# Altium schematic sheet WPD_PLL.SchDoc
size A4; SheetNumber: 16; SheetTotal: 26
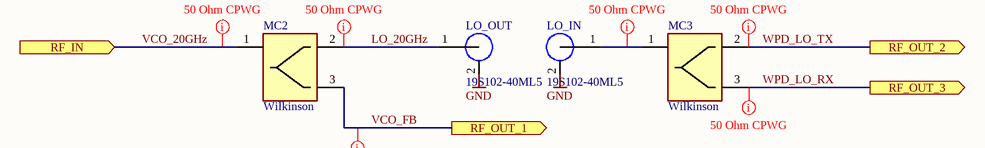
[diagram p0: WPD_PLL.SchDoc]

## Parts
LO_IN  19S102-40ML5  [Rosenberger_19S102-40ML5]
LO_OUT  19S102-40ML5  [Rosenberger_19S102-40ML5]
MC2  Wilkinson  [Wilkinson_8GHz_RO4350B_254um]  (net tie, no BOM)
MC3  Wilkinson  [Wilkinson_8GHz_RO4350B_254um]  (net tie, no BOM)

## Ports
RF_IN (in, see Top_Level[4B]), RF_OUT_1 (out, see Top_Level[4B]), RF_OUT_2 (out, see Top_Level[4B]), RF_OUT_3 (out, see Top_Level[4B])

## Nets
GND: LO_IN.2 LO_OUT.2
LO_20GHz: LO_OUT.1 MC2.2
VCO_20GHz: MC2.1 ; port RF_IN
VCO_FB: MC2.3 ; port RF_OUT_1
WPD_LO_RX: MC3.3 ; port RF_OUT_3
WPD_LO_TX: MC3.2 ; port RF_OUT_2
NetLO_IN_1: LO_IN.1 MC3.1

## Layout directives
net class 50Ohm_CPWG: LO_20GHz, NetLO_IN_1, VCO_20GHz, VCO_FB, WPD_LO_RX, WPD_LO_TX

## Library data of the parts
LO_IN LO_OUT = X000008: Manufacturer: Rosenberger; ID: X000008; Type: SMP Coax PCB Vertical Mount; Manufacturer Part Number: 19S102-40ML5; Part Value: 19S102-40ML5; ComponentLink1Description: Datasheet; ComponentLink1URL: https://products.rosenberger.com/_ocassets/db/19S102-40ML5.pdf; Supplier 1: Mouser; Supplier Part Number 1: 476-19S102-40ML5; Supplier 2: Digikey; Supplier Part Number 2: 476-19S102-40ML5
MC2 MC3 = LG000001: Substrate Type: RO4350B; Substrate Height: 254um; Design Frequency: 8GHz; ID: LG000001; Type: Wilkinson